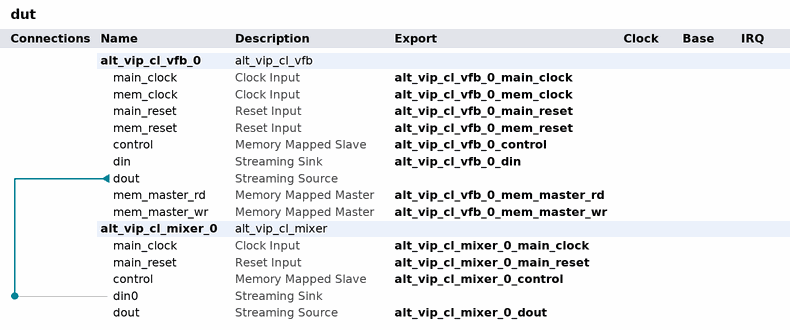
[diagram p0: system contents]
# Platform Designer (Qsys) system dut, Cyclone V 5CEBA2F17A7
# Parameters at their usual value, and those the tool derives, are not listed.
package require qsys
create_system dut
set_project_property DEVICE_FAMILY {Cyclone V}
set_project_property DEVICE 5CEBA2F17A7

add_instance alt_vip_cl_vfb_0 alt_vip_cl_vfb 17.1
set_instance_parameter_value alt_vip_cl_vfb_0 CLOCKS_ARE_SEPARATE 1
set_instance_parameter_value alt_vip_cl_vfb_0 DROP_FRAMES 1
set_instance_parameter_value alt_vip_cl_vfb_0 DROP_REPEAT_USER 1
set_instance_parameter_value alt_vip_cl_vfb_0 IS_FRAME_READER 0
set_instance_parameter_value alt_vip_cl_vfb_0 MAX_HEIGHT 380
set_instance_parameter_value alt_vip_cl_vfb_0 MAX_WIDTH 560
set_instance_parameter_value alt_vip_cl_vfb_0 MEM_BASE_ADDR 0
set_instance_parameter_value alt_vip_cl_vfb_0 MEM_BUFFER_OFFSET 16777216
set_instance_parameter_value alt_vip_cl_vfb_0 MEM_PORT_WIDTH 128
set_instance_parameter_value alt_vip_cl_vfb_0 PIXELS_IN_PARALLEL 4
set_instance_parameter_value alt_vip_cl_vfb_0 READER_RUNTIME_CONTROL 0
set_instance_parameter_value alt_vip_cl_vfb_0 READ_FIFO_DEPTH 64
set_instance_parameter_value alt_vip_cl_vfb_0 USER_PACKETS_MAX_STORAGE 0
set_instance_parameter_value alt_vip_cl_vfb_0 USE_BUFFER_OFFSET 0
set_instance_parameter_value alt_vip_cl_vfb_0 WRITER_RUNTIME_CONTROL 1
set_instance_parameter_value alt_vip_cl_vfb_0 WRITE_BURST_TARGET 32
set_instance_parameter_value alt_vip_cl_vfb_0 WRITE_FIFO_DEPTH 64

add_instance alt_vip_cl_mixer_0 alt_vip_cl_mixer 17.1
set_instance_parameter_value alt_vip_cl_mixer_0 ALPHA_ENABLE 0
set_instance_parameter_value alt_vip_cl_mixer_0 ALPHA_STREAMS_ENABLE 0
set_instance_parameter_value alt_vip_cl_mixer_0 BITS_PER_SYMBOL 8
set_instance_parameter_value alt_vip_cl_mixer_0 COLOR_PLANES_ARE_IN_PARALLEL 1
set_instance_parameter_value alt_vip_cl_mixer_0 COLOR_SPACE RGB
set_instance_parameter_value alt_vip_cl_mixer_0 FAMILY {Cyclone V}
set_instance_parameter_value alt_vip_cl_mixer_0 IS_422 0
set_instance_parameter_value alt_vip_cl_mixer_0 LAYER_POSITION_ENABLE 0
set_instance_parameter_value alt_vip_cl_mixer_0 MAX_HEIGHT 380
set_instance_parameter_value alt_vip_cl_mixer_0 MAX_WIDTH 560
set_instance_parameter_value alt_vip_cl_mixer_0 NO_OF_INPUTS 1
set_instance_parameter_value alt_vip_cl_mixer_0 NUMBER_OF_COLOR_PLANES 2
set_instance_parameter_value alt_vip_cl_mixer_0 PATTERN colorbars
set_instance_parameter_value alt_vip_cl_mixer_0 PIPELINE_READY 0
set_instance_parameter_value alt_vip_cl_mixer_0 PIXELS_IN_PARALLEL 4
set_instance_parameter_value alt_vip_cl_mixer_0 UNIFORM_VALUE_BCR 0
set_instance_parameter_value alt_vip_cl_mixer_0 UNIFORM_VALUE_GCB 0
set_instance_parameter_value alt_vip_cl_mixer_0 UNIFORM_VALUE_RY 0
set_instance_parameter_value alt_vip_cl_mixer_0 USER_PACKET_FIFO_DEPTH 0
set_instance_parameter_value alt_vip_cl_mixer_0 USER_PACKET_SUPPORT DISCARD

# connections
add_connection alt_vip_cl_vfb_0.dout alt_vip_cl_mixer_0.din0 avalon_streaming

# exported interfaces
add_interface alt_vip_cl_mixer_0_control avalon slave
set_interface_property alt_vip_cl_mixer_0_control EXPORT_OF alt_vip_cl_mixer_0.control
add_interface alt_vip_cl_mixer_0_dout avalon_streaming source
set_interface_property alt_vip_cl_mixer_0_dout EXPORT_OF alt_vip_cl_mixer_0.dout
add_interface alt_vip_cl_mixer_0_main_clock clock sink
set_interface_property alt_vip_cl_mixer_0_main_clock EXPORT_OF alt_vip_cl_mixer_0.main_clock
add_interface alt_vip_cl_mixer_0_main_reset reset sink
set_interface_property alt_vip_cl_mixer_0_main_reset EXPORT_OF alt_vip_cl_mixer_0.main_reset
add_interface alt_vip_cl_vfb_0_control avalon slave
set_interface_property alt_vip_cl_vfb_0_control EXPORT_OF alt_vip_cl_vfb_0.control
add_interface alt_vip_cl_vfb_0_din avalon_streaming sink
set_interface_property alt_vip_cl_vfb_0_din EXPORT_OF alt_vip_cl_vfb_0.din
add_interface alt_vip_cl_vfb_0_main_clock clock sink
set_interface_property alt_vip_cl_vfb_0_main_clock EXPORT_OF alt_vip_cl_vfb_0.main_clock
add_interface alt_vip_cl_vfb_0_main_reset reset sink
set_interface_property alt_vip_cl_vfb_0_main_reset EXPORT_OF alt_vip_cl_vfb_0.main_reset
add_interface alt_vip_cl_vfb_0_mem_clock clock sink
set_interface_property alt_vip_cl_vfb_0_mem_clock EXPORT_OF alt_vip_cl_vfb_0.mem_clock
add_interface alt_vip_cl_vfb_0_mem_master_rd avalon master
set_interface_property alt_vip_cl_vfb_0_mem_master_rd EXPORT_OF alt_vip_cl_vfb_0.mem_master_rd
add_interface alt_vip_cl_vfb_0_mem_master_wr avalon master
set_interface_property alt_vip_cl_vfb_0_mem_master_wr EXPORT_OF alt_vip_cl_vfb_0.mem_master_wr
add_interface alt_vip_cl_vfb_0_mem_reset reset sink
set_interface_property alt_vip_cl_vfb_0_mem_reset EXPORT_OF alt_vip_cl_vfb_0.mem_reset

set_interconnect_requirement {$system} qsys_mm.clockCrossingAdapter HANDSHAKE
set_interconnect_requirement {$system} qsys_mm.enableEccProtection FALSE
set_interconnect_requirement {$system} qsys_mm.insertDefaultSlave FALSE
set_interconnect_requirement {$system} qsys_mm.maxAdditionalLatency 1

save_system dut.qsys
